# Altium schematic sheet EstMeteoSCH.SchDoc
size A4
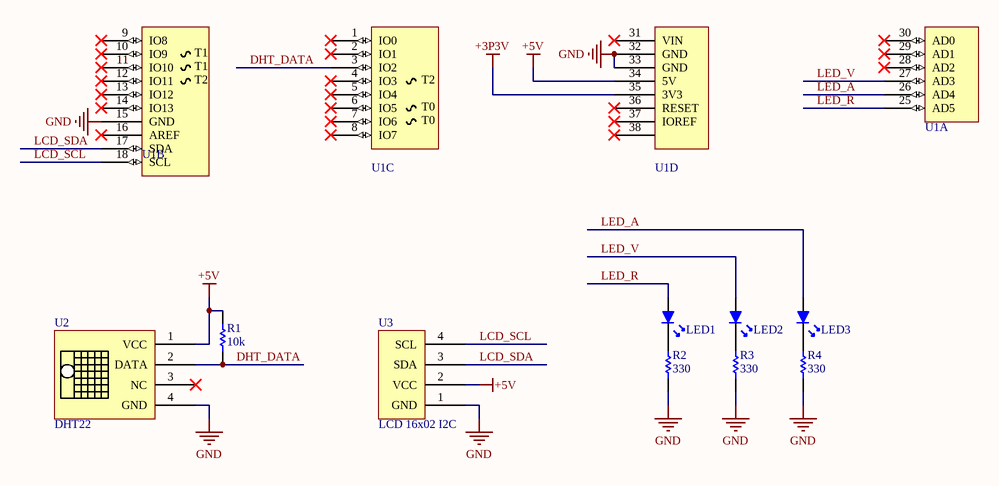
[diagram p0: EstMeteoSCH.SchDoc]

## Parts
LED1  LED  [LED 1206]  (value not drawn)
LED2  LED  [LED 1206]  (value not drawn)
LED3  LED  [LED 1206]  (value not drawn)
R1  10k  [R 1206]
R2  330  [R 1206]
R3  330  [R 1206]
R4  330  [R 1206]
U1  ARDUINO UNO SIN MISOMOSI  [ARDUINO_SHIELD_SIN_MALE]  (value not drawn)  (parts A,B,C,D of 4)
U2  DHT22  [DHT22]
U3  LCD 16x02 I2C  [LCD I2C]

## Nets
+3P3V: U1.35(3V3)
+5V: R1.2 U1.34(5V) U2.1(VCC) U3.2(VCC)
GND: R2.1 R3.1 R4.1 U1.15(GND) U1.32(GND) U1.33(GND) U2.4(GND) U3.1(GND)
DHT_DATA: R1.1 U1.3(IO2) U2.2(DATA)
LCD_SCL: U1.18(SCL) U3.4(SCL)
LCD_SDA: U1.17(SDA) U3.3(SDA)
LED_A: LED3.1(A) U1.26(AD4)
LED_R: LED1.1(A) U1.25(AD5)
LED_V: LED2.1(A) U1.27(AD3)
NetLED1_2: LED1.2(K) R2.2
NetLED2_2: LED2.2(K) R3.2
NetLED3_2: LED3.2(K) R4.2

Not connected (* = marked no-connect by the designer): U1 1(IO0)* 2(IO1)* 4(IO3)* 5(IO4)* 6(IO5)* 7(IO6)* 8(IO7)* 9(IO8)* 10(IO9)* 11(IO10)* 12(IO11)* 13(IO12)* 14(IO13)* 16(AREF)* 28(AD2)* 29(AD1)* 30(AD0)* 31(VIN)* 36(RESET)* 37(IOREF)* 38*; U2 3(NC)*

## Notes on the sheet
- (in symbol ARDUINO UNO SIN MISOMOSI, part B) T1; T2
- (in symbol ARDUINO UNO SIN MISOMOSI, part C) T2; T0

## Library data of the parts
LED1-LED3 = LED: .Creator: SR; .PCBCheck: Used; .SCHCheck: Used
R1-R4 = R: Resistencia; .Creator: SR; .PCBCheck: Used; .SCHCheck: Used; Category: Resistencias
U2 = 393: SENSOR TEMP/HUMIDTY AM2302 DHT22; Manufacturer: Adafruit Industries LLC; Sensor Type: Humidity, Temperature; Humidity Range: 0 ~ 100% RH; Output Type: Digital; Output: 8b; Accuracy: ±2%; Response Time: 2s; Voltage - Supply: 3.3 V ~ 5.5 V; Supplier 1: Digi-Key; Manufacturer Part Number: 393; RoHS: RoHS Compliant; Category: Sensors, Transducers; Stock 1: 121; Pricing 1: 1=15, 10=13.5 (USD); Sensitivity: -; Mounting Type: Chassis Mount; Operating Temperature: -40°C ~ 80°C; ComponentLink1URL: http://www.adafruit.com/datasheets/Digital%20humidity%20and%20temperature%20sensor%20AM2302.pdf; ComponentLink1Description: http://www.adafruit.com/datasheets/Digital%20humidity%20and%20temperature%20sensor%20AM2302.pdf; Supplier Part Number 1: 1528-1229-ND
U3 = LCM-S01602DTR/A: LCD MODULE 16X2 CHARACTER; Manufacturer: Lumex Opto/Components Inc.; Number of Characters: 32; Character Format: 5 x 8 Dots; Display Type: TN - Twisted Nematic; Display Mode: Reflective; Character Size: 5.56mm H x 2.96mm W; Outline L x W x H: 80.00mm x 36.00mm x 8.80mm; Viewing Area: 66.00mm L x 16.00mm W; Backlight: Without Backlight; Voltage - Supply: 5V; Dot Size: 0.56mm W x 0.66mm H; Interface: Parallel; Background Color: Green; Supplier 1: Digi-Key; Manufacturer Part Number: LCM-S01602DTR/A; RoHS: RoHS Compliant; Category: Optoelectronics; Stock 1: 521; Pricing 1: 1=12.93, 10=11.707, 100=7.8048, 250=7.317, 500=6.70726, 1000=6.3414, 2500=6.0975, 5000=5.97555, 10000=5.8536 (USD); Display Format: 16 x 2; Operating Temperature: 0°C ~ 50°C; Text Color: -; ComponentLink1URL: http://media.digikey.com/pdf/Data%20Sheets/Lumex%20PDFs/LCM-x01602Dxx+A-page1%5B1%5D.pdf; ComponentLink1Description: http://media.digikey.com/pdf/Data%20Sheets/Lumex%20PDFs/LCM-x01602Dxx+A-page1%5B1%5D.pdf; Supplier Part Number 1: 67-1779-ND